# EAGLE design dummy_battery (EAGLE 9.6.2)
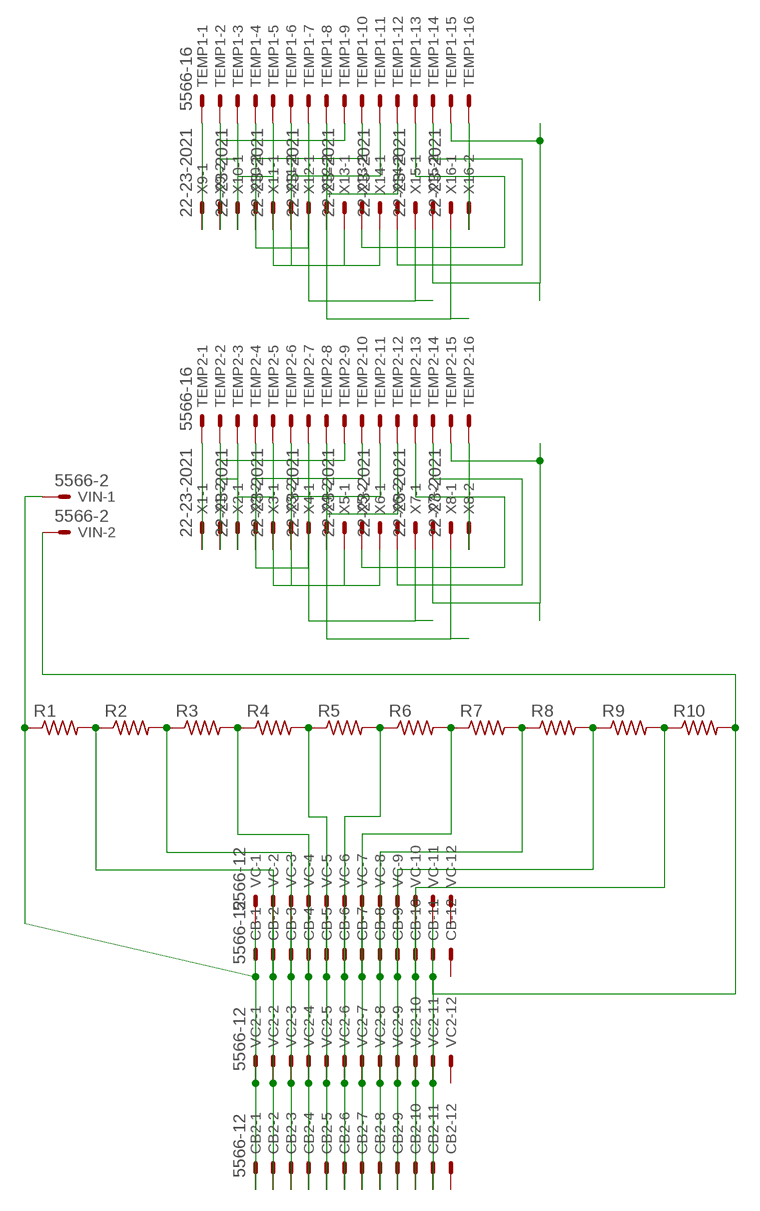
[diagram p0: schematic, sheet 1]

## Parts
CB  5566-12  [5566-12]
CB2  5566-12  [5566-12]
R1  R-US_R0805  [R0805]
R2  R-US_R0805  [R0805]
R3  R-US_R0805  [R0805]
R4  R-US_R0805  [R0805]
R5  R-US_R0805  [R0805]
R6  R-US_R0805  [R0805]
R7  R-US_R0805  [R0805]
R8  R-US_R0805  [R0805]
R9  R-US_R0805  [R0805]
R10  R-US_R0805  [R0805]
TEMP1  5566-16  [5566-16]
TEMP2  5566-16  [5566-16]
VC  5566-12  [5566-12]
VC2  5566-12  [5566-12]
VIN  5566-2  [5566-2]
X1  22-23-2021  [22-23-2021]
X2  22-23-2021  [22-23-2021]
X3  22-23-2021  [22-23-2021]
X4  22-23-2021  [22-23-2021]
X5  22-23-2021  [22-23-2021]
X6  22-23-2021  [22-23-2021]
X7  22-23-2021  [22-23-2021]
X8  22-23-2021  [22-23-2021]
X9  22-23-2021  [22-23-2021]
X10  22-23-2021  [22-23-2021]
X11  22-23-2021  [22-23-2021]
X12  22-23-2021  [22-23-2021]
X13  22-23-2021  [22-23-2021]
X14  22-23-2021  [22-23-2021]
X15  22-23-2021  [22-23-2021]
X16  22-23-2021  [22-23-2021]

## Nets
N$1: CB2.2 CB.2 R1.2 R2.1 VC2.2 VC.2
N$2: CB2.3 CB.3 R2.2 R3.1 VC2.3 VC.3
N$3: CB2.4 CB.4 R3.2 R4.1 VC2.4 VC.4
N$4: CB2.5 CB.5 R4.2 R5.1 VC2.5 VC.5
N$5: CB2.6 CB.6 R5.2 R6.1 VC2.6 VC.6
N$6: CB2.7 CB.7 R6.2 R7.1 VC2.7 VC.7
N$7: CB2.8 CB.8 R7.2 R8.1 VC2.8 VC.8
N$8: CB2.9 CB.9 R8.2 R9.1 VC2.9 VC.9
N$9: CB2.10 CB.10 R9.2 R10.1 VC2.10 VC.10
N$10: CB2.1 CB.1 R1.1 VC2.1 VC.1 VIN.1
N$11: CB2.11 CB.11 R10.2 VC2.11 VC.11 VIN.2
N$12: TEMP2.1 X1.1
N$13: TEMP2.9 X1.2
N$14: TEMP2.2 X2.1
N$15: TEMP2.10 X2.2
N$16: TEMP2.3 X3.1
N$17: TEMP2.11 X3.2
N$18: TEMP2.4 X4.1
N$19: TEMP2.12 X4.2
N$20: TEMP2.5 X5.1
N$21: TEMP2.13 X5.2
N$22: TEMP2.6 X6.1
N$23: TEMP2.14 X6.2
N$24: TEMP2.7 X7.1
N$25: TEMP2.15 X7.2
N$26: TEMP2.8 X8.1
N$27: TEMP2.16 X8.2
N$28: TEMP1.1 X9.1
N$29: TEMP1.9 X9.2
N$30: TEMP1.2 X10.1
N$31: TEMP1.10 X10.2
N$32: TEMP1.3 X11.1
N$33: TEMP1.11 X11.2
N$34: TEMP1.4 X12.1
N$35: TEMP1.12 X12.2
N$36: TEMP1.5 X13.1
N$37: TEMP1.13 X13.2
N$38: TEMP1.6 X14.1
N$39: TEMP1.14 X14.2
N$40: TEMP1.7 X15.1
N$41: TEMP1.15 X15.2
N$42: TEMP1.8 X16.1
N$43: TEMP1.16 X16.2
Unconnected: CB2.12 CB.12 VC2.12 VC.12

## Library data of the parts
CB CB2 VC VC2 = con-molex:5566-12: Mini FIT connector 12 pol Source: http://www.molex.com; MF: MOLEX; OC_FARNELL: unknown; OC_NEWARK: unknown
R1-R10 = rcl:R-US_: RESISTOR, American symbol; SPICEPREFIX: R
TEMP1 TEMP2 = con-molex:5566-16: Mini FIT connector 16 pol Source: http://www.molex.com; MF: MOLEX; OC_FARNELL: unknown; OC_NEWARK: unknown
VIN = con-molex:5566-2: Mini FIT connector 2 pol Source: http://www.molex.com; MF: MOLEX; OC_FARNELL: 1822072; OC_NEWARK: unknown
X1-X16 = con-molex:22-23-2021: .100" (2.54mm) Center Header - 2 Pin; MF: MOLEX; MPN: 22-23-2021; OC_FARNELL: 1462926; OC_NEWARK: 25C3832

## Board
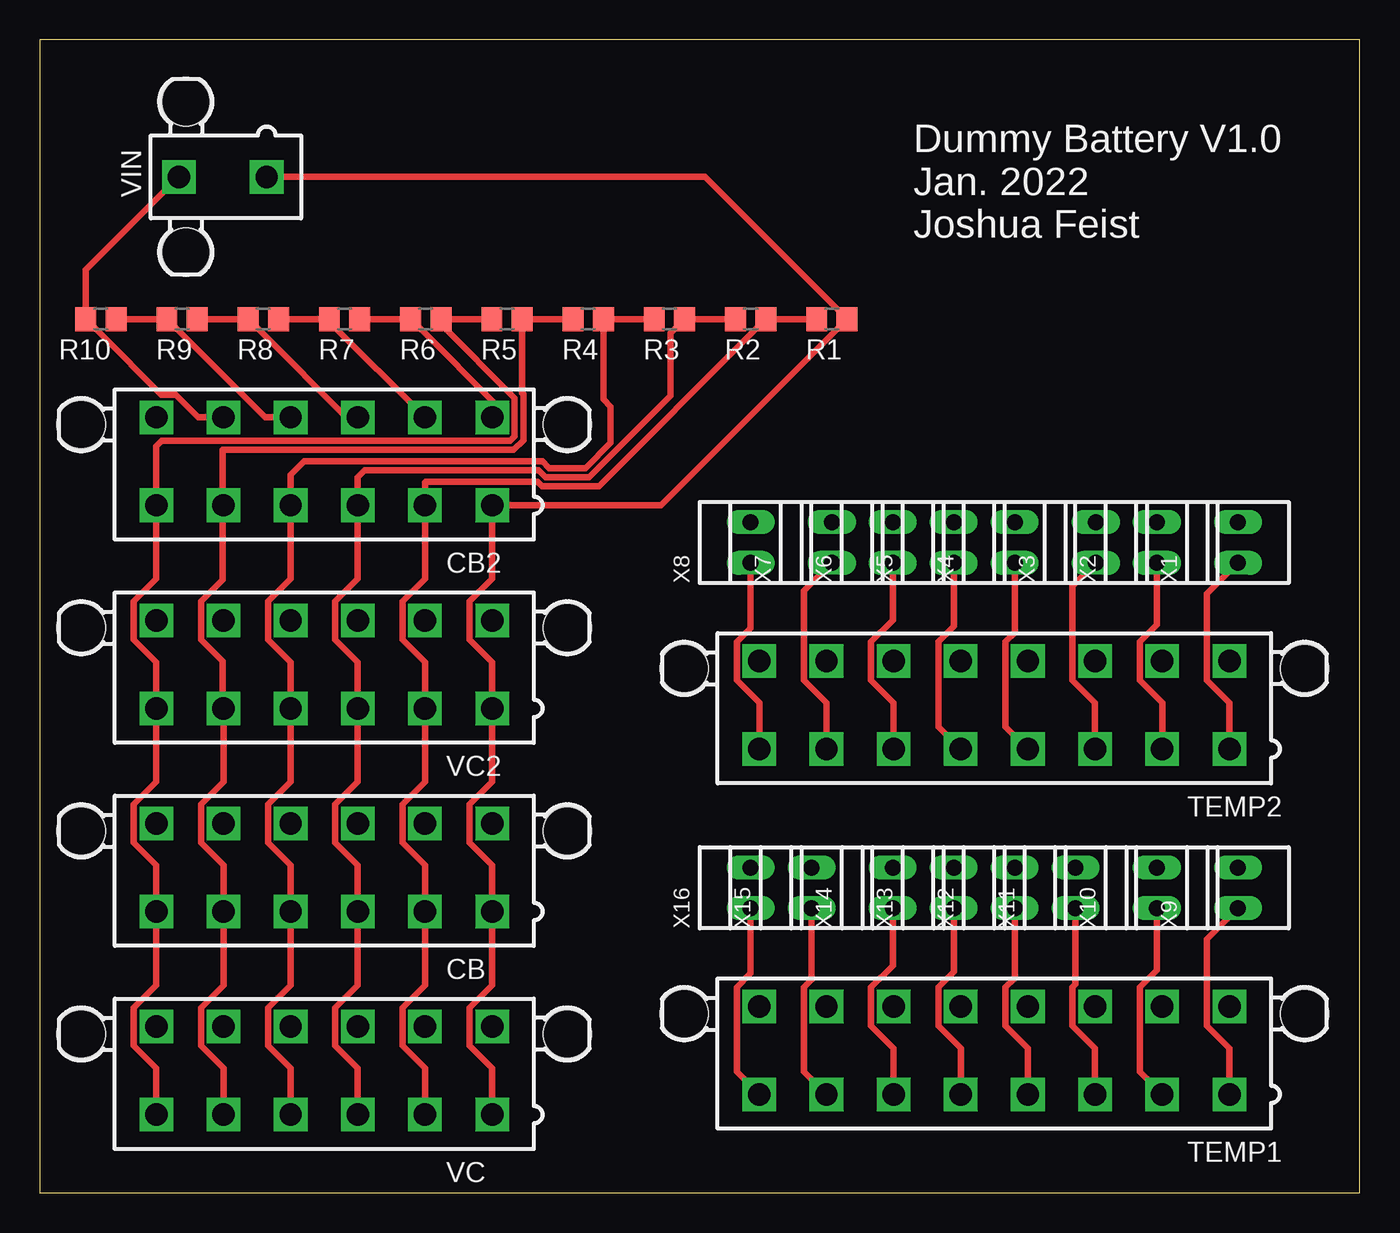
[diagram p1: board, top side]
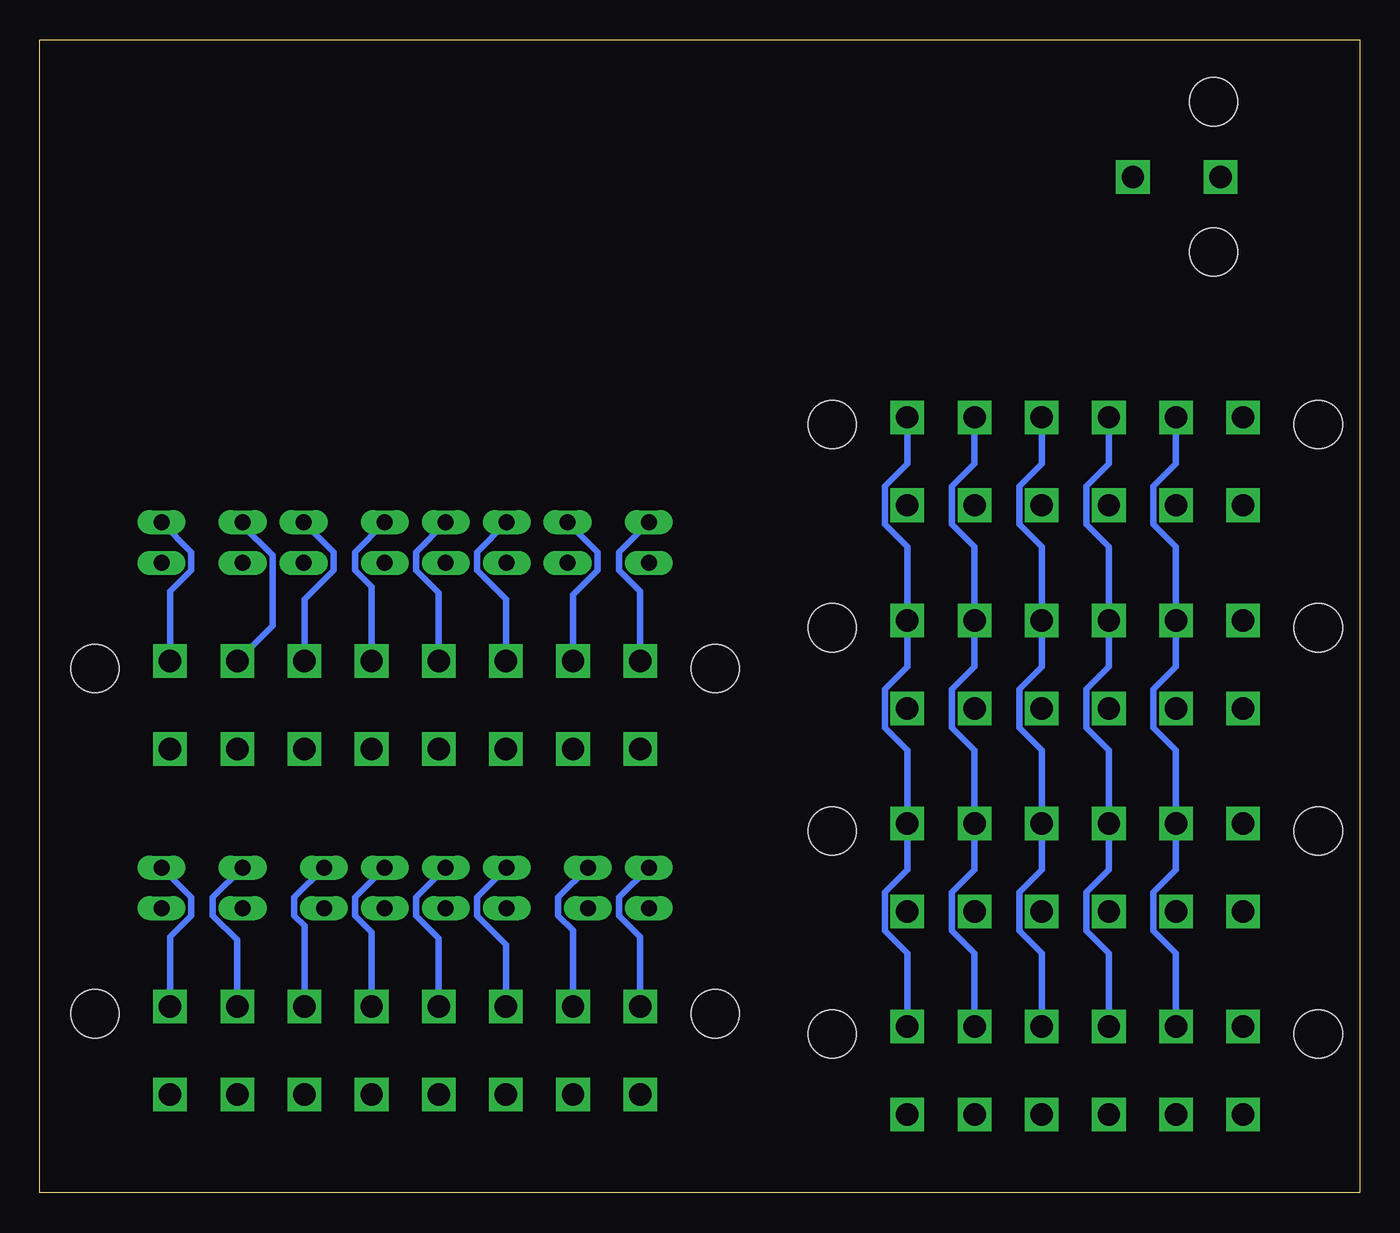
[diagram p2: board, bottom side, seen from below]

Size 82.53 x 72.06 mm. Coordinates in mm from the lower left corner, seen from the top.
Outline: 0,0 82.53,0 82.53,72.06 0,72.06 0,0
Copper layers (1*16): Top 0.035mm / dielectric 1.5mm / Bottom 0.035mm
Design rules "default": minimum track width 6mil, minimum drill 0.35mm, track to track 6mil, track to pad 6mil, pad to pad 6mil, via to via 6mil, smd to smd 6mil, copper to edge 40mil, drill to drill 6mil, minimum pad ring 10mil, minimum via ring 8mil, stop-mask expansion 4mil, vias tented up to drill 0mil, thermal gap 10mil

### Footprints (pad centres in the part's own frame; a part is rotated, then mirrored left to right if it is on the bottom)
5566-12 = drill 1.4 square: 1 10.5,-2.75; 2 6.3,-2.75; 3 2.1,-2.75; 4 -2.1,-2.75; 5 -6.3,-2.75; 6 -10.5,-2.75; 7 10.5,2.75; 8 6.3,2.75; 9 2.1,2.75; 10 -2.1,2.75; 11 -6.3,2.75; 12 -10.5,2.75 | hole 3: 15.2,2.29; -15.2,2.29
R0805 = smd 1.3 x 1.5: 1 -0.95,0; 2 0.95,0
5566-16 = drill 1.4 square: 1 14.7,-2.75; 2 10.5,-2.75; 3 6.3,-2.75; 4 2.1,-2.75; 5 -2.1,-2.75; 6 -6.3,-2.75; 7 -10.5,-2.75; 8 -14.7,-2.75; 9 14.7,2.75; 10 10.5,2.75; 11 6.3,2.75; 12 2.1,2.75; 13 -2.1,2.75; 14 -6.3,2.75; 15 -10.5,2.75; 16 -14.7,2.75 | hole 3: 19.4,2.29; -19.4,2.29
5566-2 = drill 1.4 square: 1 0,-2.75; 2 0,2.75 | hole 3: 4.7,2.29; -4.7,2.29
22-23-2021 = drill 1 long: 1 -1.27,0; 2 1.27,0

### Placement (x,y rotation side)
CB  17.78,20.32 0 top
CB2  17.78,45.72 0 top
R1  49.53,54.61 180 top
R2  44.45,54.61 180 top
R3  39.37,54.61 180 top
R4  34.29,54.61 180 top
R5  29.21,54.61 180 top
R6  24.13,54.61 180 top
R7  19.05,54.61 180 top
R8  13.97,54.61 180 top
R9  8.89,54.61 180 top
R10  3.81,54.61 180 top
TEMP1  59.69,8.89 0 top
TEMP2  59.69,30.48 0 top
VC  17.78,7.62 0 top
VC2  17.78,33.02 0 top
VIN  11.43,63.5 90 top
X1  74.93,40.64 90 top
X2  69.85,40.64 90 top
X3  66.04,40.64 90 top
X4  60.96,40.64 90 top
X5  57.15,40.64 90 top
X6  53.34,40.64 90 top
X7  49.53,40.64 90 top
X8  44.45,40.64 90 top
X9  74.93,19.05 90 top
X10  69.85,19.05 90 top
X11  64.77,19.05 90 top
X12  60.96,19.05 90 top
X13  57.15,19.05 90 top
X14  53.34,19.05 90 top
X15  48.26,19.05 90 top
X16  44.45,19.05 90 top

### Tracks (layer width: path | path; a pad name or v marks a point on that pad's centre or on a via)
N$1
  Top 0.406: VC.2 24.08,7.77 22.67,9.17 22.67,11.57 24.08,12.97 CB.2 24.08,20.47 22.67,21.87 22.67,24.27 24.08,25.67 VC2.2 24.08,33.17 22.67,34.57 22.67,36.97 24.08,38.37 CB2.2 24.08,44.4 24.13,44.45 31.11,44.45 31.39,44.17 34.97,44.17 44.51,53.71 44.51,53.72 R2.1 R1.2
N$2
  Top 0.406: VC.3 19.88,7.77 18.47,9.17 18.47,11.57 19.88,12.97 CB.3 19.88,20.47 18.47,21.87 18.47,24.27 19.88,25.67 VC2.3 19.88,33.17 18.47,34.57 18.47,36.97 19.88,38.37 CB2.3 19.88,44.72 20.32,45.16 31.19,45.16 31.62,44.73 34.34,44.73 39.43,49.82 39.43,53.72 R3.1 R2.2
N$3
  Top 0.406: VC.4 15.68,7.77 14.27,9.17 14.27,11.57 15.68,12.97 CB.4 15.68,20.47 14.27,21.87 14.27,24.27 15.68,25.67 VC2.4 15.68,33.17 14.27,34.57 14.27,36.97 15.68,38.37 CB2.4 15.68,44.89 16.51,45.72 31.42,45.72 31.85,45.29 34.11,45.29 35.7,46.88 35.7,49.14 35.24,49.6 R4.1 R3.2
N$4
  Top 0.406: VC.5 11.48,7.77 10.07,9.17 10.07,11.57 11.48,12.97 CB.5 11.48,20.47 10.07,21.87 10.07,24.27 11.48,25.67 VC2.5 11.43,30.32 11.43,33.22 10.07,34.57 10.07,36.97 11.43,38.32 11.43,43.02 | R4.2 R5.1 30.16,49.98 30.24,49.9 30.24,47.04 29.63,46.43 11.43,46.43 11.43,43.02 | 11.43,43.02 CB2.5
N$5
  Top 0.406: VC.6 7.28,7.77 5.87,9.17 5.87,11.57 7.28,12.97 CB.6 7.28,20.47 5.87,21.87 5.87,24.27 7.28,25.67 VC2.6 7.28,33.17 5.87,34.57 5.87,36.97 7.28,38.37 CB2.6 7.28,46.65 7.62,46.99 29.4,46.99 29.69,47.27 29.69,49.67 25.08,54.27 R6.1 R5.2
N$6
  Top 0.406: R7.1 R6.2 24.07,53.72 24.07,53.71 28.28,49.51 CB2.7
  Bottom 0.406: CB2.7 28.28,45.57 29.69,44.17 29.69,41.77 28.28,40.37 VC2.7 28.28,32.87 29.69,31.47 29.69,29.07 28.28,27.67 CB.7 28.28,20.17 29.69,18.77 29.69,16.37 28.28,14.97 VC.7
N$7
  Top 0.406: R8.1 R7.2 18.1,54.45 CB2.8
  Bottom 0.406: CB2.8 24.08,45.57 25.49,44.17 25.49,41.77 24.08,40.37 VC2.8 24.08,32.87 25.49,31.47 25.49,29.07 24.08,27.67 CB.8 24.08,20.17 25.49,18.77 25.49,16.37 24.08,14.97 VC.8
N$8
  Top 0.406: R9.1 R8.2 13.91,53.72 13.91,53.71 19.16,48.47 CB2.9
  Bottom 0.406: CB2.9 19.88,45.57 21.29,44.17 21.29,41.77 19.88,40.37 VC2.9 19.88,32.87 21.29,31.47 21.29,29.07 19.88,27.67 CB.9 19.88,20.17 21.29,18.77 21.29,16.37 19.88,14.97 VC.9
N$9
  Top 0.406: R10.1 R9.2 8.83,53.72 8.83,53.71 12.67,49.88 12.68,49.88 14.08,48.47 CB2.10
  Bottom 0.406: CB2.10 15.68,45.57 17.09,44.17 17.09,41.77 15.68,40.37 VC2.10 15.68,32.87 17.09,31.47 17.09,29.07 15.68,27.67 CB.10 15.68,20.17 17.09,18.77 17.09,16.37 15.68,14.97 VC.10
N$10
  Top 0.406: VC.1 28.28,7.77 26.87,9.17 26.87,11.57 28.28,12.97 CB.1 28.28,20.47 26.87,21.87 26.87,24.27 28.28,25.67 VC2.1 28.28,33.17 26.87,34.57 26.87,36.97 28.28,38.37 CB2.1 38.84,42.97 49.59,53.71 49.59,53.72 R1.1 49.59,55.5 49.59,55.51 41.59,63.5 VIN.1
N$11
  Top 0.406: CB2.11 9.88,48.47 8.48,49.88 7.59,49.88 3.75,53.71 3.75,53.72 R10.2 2.86,57.68 VIN.2
  Bottom 0.406: CB2.11 11.48,45.57 12.89,44.17 12.89,41.77 11.48,40.37 VC2.11 11.48,32.87 12.89,31.47 12.89,29.07 11.48,27.67 CB.11 11.48,20.17 12.89,18.77 12.89,16.37 11.48,14.97 VC.11
N$12
  Top 0.406: TEMP2.1 74.39,30.63 72.98,32.03 72.98,37.42 X1.1
N$13
  Bottom 0.406: TEMP2.9 74.39,37.59 73.07,38.91 73.07,40.05 X1.2
N$14
  Top 0.406: TEMP2.2 70.19,30.63 68.78,32.03 68.78,34.43 69.85,35.49 X2.1
N$15
  Bottom 0.406: X2.2 69.85,41.69 67.99,39.83 67.99,35.43 TEMP2.10
N$16
  Top 0.406: TEMP2.3 65.99,30.63 64.58,32.03 64.58,37.91 X3.1
N$17
  Bottom 0.406: TEMP2.11 65.99,37.1 64.18,38.91 64.18,40.05 X3.2
N$18
  Top 0.406: X4.1 60.96,35 60.38,34.43 60.38,29.14 TEMP2.4
N$19
  Bottom 0.406: TEMP2.12 61.79,37.88 62.82,38.91 62.82,40.05 X4.2
N$20
  Top 0.406: X5.1 57.15,35.39 56.18,34.43 56.18,29.14 TEMP2.5
N$21
  Bottom 0.406: TEMP2.13 57.59,37.49 59.01,38.91 59.01,40.05 X5.2
N$22
  Top 0.406: TEMP2.6 53.39,30.63 51.98,32.03 51.98,34.43 53.34,35.78 X6.1
N$23
  Bottom 0.406: TEMP2.14 53.39,37.1 55.2,38.91 55.2,40.05 X6.2
N$24
  Top 0.406: TEMP2.7 49.19,30.63 47.78,32.03 47.78,37.62 X7.1
N$25
  Bottom 0.406: TEMP2.15 49.19,37.39 47.67,38.91 47.67,40.05 X7.2
N$26
  Top 0.406: TEMP2.8 44.99,30.63 43.58,32.03 43.58,34.43 44.45,35.29 X8.1
N$27
  Bottom 0.406: TEMP2.16 44.99,37.59 46.31,38.91 46.31,40.05 X8.2
N$28
  Top 0.406: TEMP1.1 74.39,9.04 72.98,10.44 72.98,15.83 X9.1
N$29
  Bottom 0.406: TEMP1.9 74.39,16 73.07,17.32 73.07,18.46 X9.2
N$30
  Top 0.406: X10.1 69.85,13.9 68.78,12.84 68.78,7.55 TEMP1.2
N$31
  Bottom 0.406: TEMP1.10 70.19,15.8 71.71,17.32 71.71,18.46 X10.2
N$32
  Top 0.406: TEMP1.3 65.99,9.04 64.58,10.44 64.58,12.84 64.77,13.02 X11.1
N$33
  Bottom 0.406: TEMP1.11 65.99,16.68 66.63,17.32 66.63,18.46 X11.2
N$34
  Top 0.406: TEMP1.4 61.79,9.04 60.38,10.44 60.38,12.84 60.96,13.41 X12.1
N$35
  Bottom 0.406: TEMP1.12 61.79,16.29 62.82,17.32 62.82,18.46 X12.2
N$36
  Top 0.406: TEMP1.5 57.59,9.04 56.18,10.44 56.18,12.84 57.15,13.8 X13.1
N$37
  Bottom 0.406: TEMP1.13 57.59,15.9 59.01,17.32 59.01,18.46 X13.2
N$38
  Top 0.406: TEMP1.6 53.39,9.04 51.98,10.44 51.98,12.84 53.34,14.19 X14.1
N$39
  Bottom 0.406: TEMP1.14 53.39,15.51 55.2,17.32 55.2,18.46 X14.2
N$40
  Top 0.406: X15.1 48.26,13.31 47.78,12.84 47.78,7.55 TEMP1.7
N$41
  Bottom 0.406: TEMP1.15 49.19,16.39 50.12,17.32 50.12,18.46 X15.2
N$42
  Top 0.406: X16.1 44.45,13.7 43.58,12.84 43.58,7.55 TEMP1.8
N$43
  Bottom 0.406: TEMP1.16 44.99,16 46.31,17.32 46.31,18.46 X16.2

### Text on the board
tPlace: Dummy Battery V1.0 / Jan. 2022 / Joshua Feist